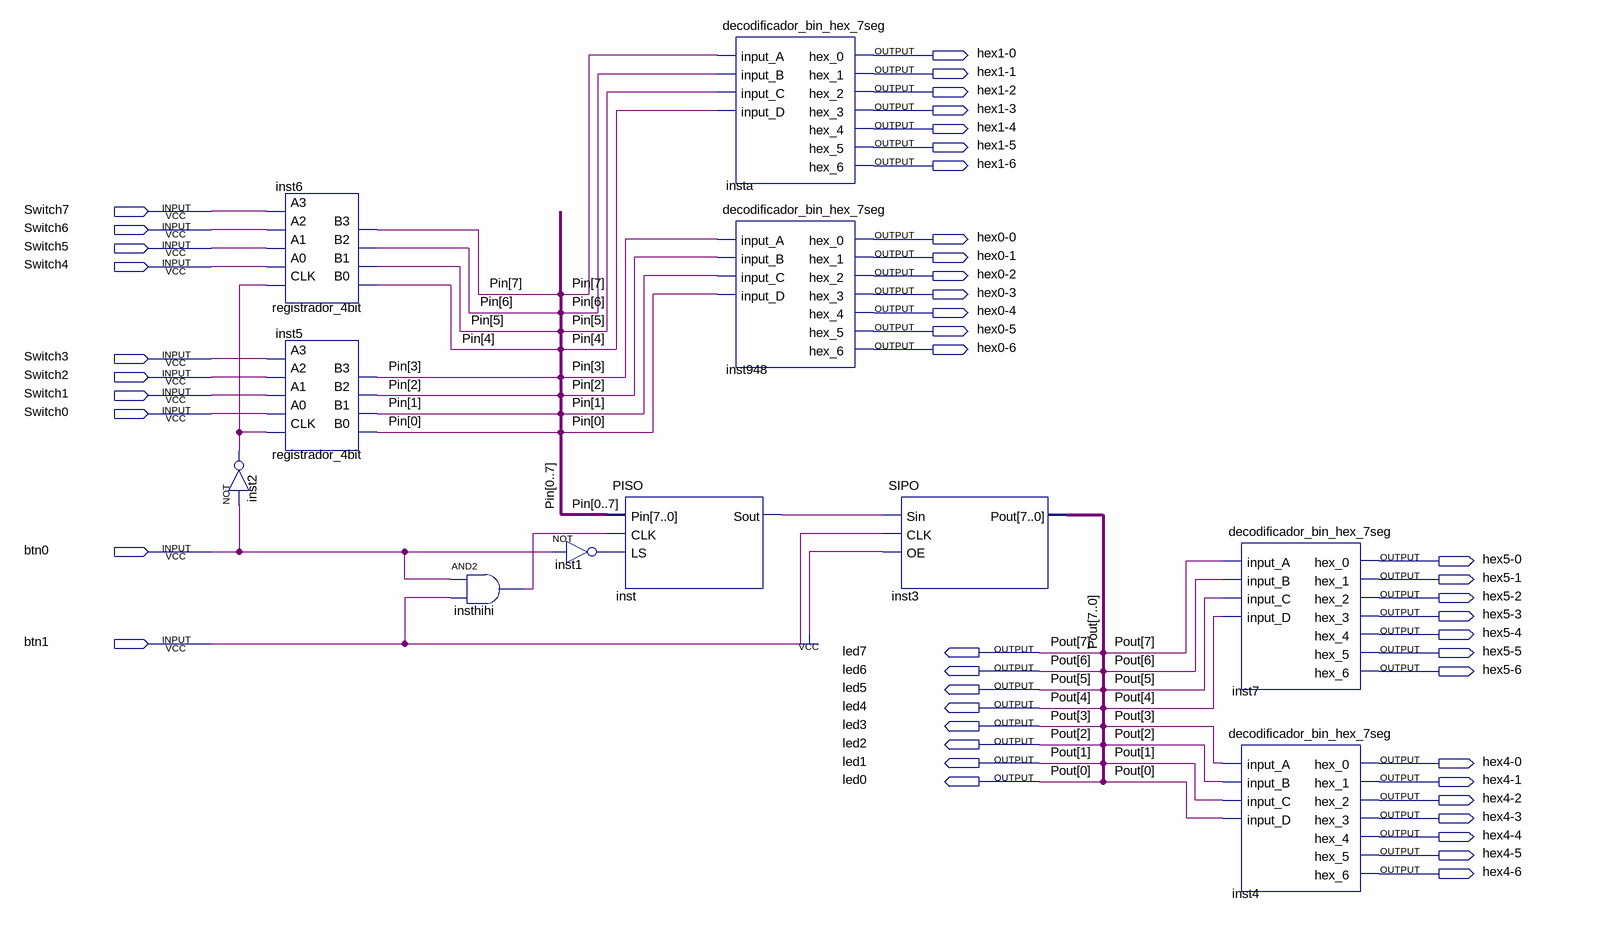
[diagram p0: schematic sheet]
// Quartus schematic SIPO-PISO.bdf as structural Verilog: 11 symbols, 46 pins
module \SIPO-PISO  (
  input  Switch7,
  input  Switch6,
  input  Switch5,
  input  Switch4,
  input  Switch3,
  input  Switch2,
  input  Switch1,
  input  Switch0,
  input  btn0,
  input  btn1,
  output \hex1-0 ,
  output \hex1-1 ,
  output \hex1-2 ,
  output \hex1-3 ,
  output \hex1-4 ,
  output \hex1-5 ,
  output \hex1-6 ,
  output \hex0-0 ,
  output \hex0-1 ,
  output \hex0-2 ,
  output \hex0-3 ,
  output \hex0-4 ,
  output \hex0-5 ,
  output \hex0-6 ,
  output \hex5-0 ,
  output \hex5-1 ,
  output \hex5-2 ,
  output \hex5-3 ,
  output \hex5-4 ,
  output led7,
  output \hex5-5 ,
  output led6,
  output \hex5-6 ,
  output led5,
  output led4,
  output led3,
  output led2,
  output led1,
  output \hex4-0 ,
  output led0,
  output \hex4-1 ,
  output \hex4-2 ,
  output \hex4-3 ,
  output \hex4-4 ,
  output \hex4-5 ,
  output \hex4-6 
);

  wire inst1_out, inst2_out, inst_sout, insthihi_out;
  wire [7:0] Pin;

  registrador_4bit inst6 (
    .CLK(inst2_out), .A0(Switch4), .A1(Switch5), .A2(Switch6), .A3(Switch7), .B0(Pin[4]), .B1(Pin[5]),
    .B2(Pin[6]), .B3(Pin[7]));
  registrador_4bit inst5 (
    .CLK(inst2_out), .A0(Switch0), .A1(Switch1), .A2(Switch2), .A3(Switch3), .B0(Pin[0]), .B1(Pin[1]),
    .B2(Pin[2]), .B3(Pin[3]));
  not inst2 (inst2_out, btn0);
  and insthihi (insthihi_out, btn0, btn1);
  not inst1 (inst1_out, btn0);
  PISO inst (
    .Pin({Pin[0], Pin[1], Pin[2], Pin[3], Pin[4], Pin[5], Pin[6], Pin[7]}), .CLK(insthihi_out),
    .LS(inst1_out), .Sout(inst_sout));
  decodificador_bin_hex_7seg insta (
    .input_A(Pin[7]), .input_B(Pin[6]), .input_C(Pin[5]), .input_D(Pin[4]), .hex_0(\hex1-0 ),
    .hex_1(\hex1-1 ), .hex_2(\hex1-2 ), .hex_3(\hex1-3 ), .hex_4(\hex1-4 ), .hex_5(\hex1-5 ), .hex_6(\hex1-6 ));
  decodificador_bin_hex_7seg inst948 (
    .input_A(Pin[3]), .input_B(Pin[2]), .input_C(Pin[1]), .input_D(Pin[0]), .hex_0(\hex0-0 ),
    .hex_1(\hex0-1 ), .hex_2(\hex0-2 ), .hex_3(\hex0-3 ), .hex_4(\hex0-4 ), .hex_5(\hex0-5 ), .hex_6(\hex0-6 ));
  SIPO inst3 (.Sin(inst_sout), .CLK(btn1), .OE(1'b1), .Pout({led7, led6, led5, led4, led3, led2, led1, led0}));
  decodificador_bin_hex_7seg inst7 (
    .input_A(led7), .input_B(led6), .input_C(led5), .input_D(led4), .hex_0(\hex5-0 ), .hex_1(\hex5-1 ),
    .hex_2(\hex5-2 ), .hex_3(\hex5-3 ), .hex_4(\hex5-4 ), .hex_5(\hex5-5 ), .hex_6(\hex5-6 ));
  decodificador_bin_hex_7seg inst4 (
    .input_A(led3), .input_B(led2), .input_C(led1), .input_D(led0), .hex_0(\hex4-0 ), .hex_1(\hex4-1 ),
    .hex_2(\hex4-2 ), .hex_3(\hex4-3 ), .hex_4(\hex4-4 ), .hex_5(\hex4-5 ), .hex_6(\hex4-6 ));

  // Other names for the same wires on the sheet: Pout[7:0] = {led7, led6, led5, led4, led3, led2, led1, led0}
endmodule
